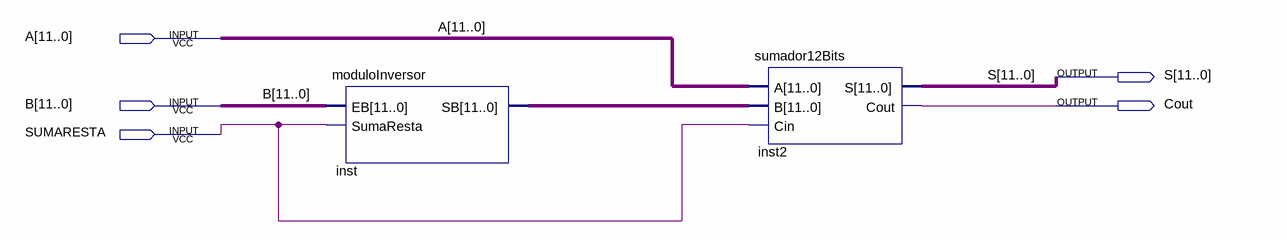
[diagram p0: schematic sheet]
// Quartus schematic sumador12BitsPosyNeg.bdf as structural Verilog: 2 symbols, 5 pins
module sumador12BitsPosyNeg (
  input  [11:0] A,
  input  [11:0] B,
  input  SUMARESTA,
  output [11:0] S,
  output Cout
);

  wire [11:0] inst_sb;

  moduloInversor inst (.EB(B), .SumaResta(SUMARESTA), .SB(inst_sb));
  sumador12Bits inst2 (.A(A), .B(inst_sb), .Cin(SUMARESTA), .S(S), .Cout(Cout));
endmodule
